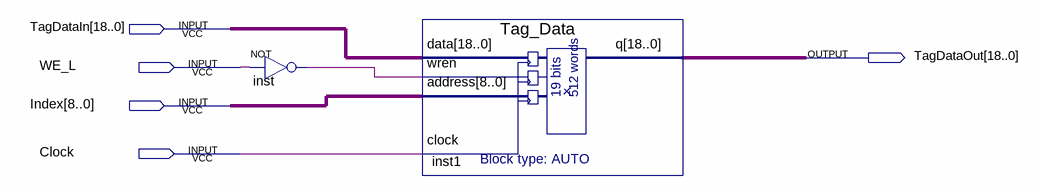
[diagram p0: schematic sheet]
// Quartus schematic TagMemory.bdf as structural Verilog: 2 symbols, 5 pins
module TagMemory (
  input  [18:0] TagDataIn,
  input  WE_L,
  input  [8:0] Index,
  input  Clock,
  output [18:0] TagDataOut
);

  wire inst_out;

  not inst (inst_out, WE_L);
  Tag_Data inst1 (.data(TagDataIn), .wren(inst_out), .address(Index), .clock(Clock), .q(TagDataOut));
endmodule
